# Altium schematic sheet Top_Level.SchDoc (part 2 of 2)
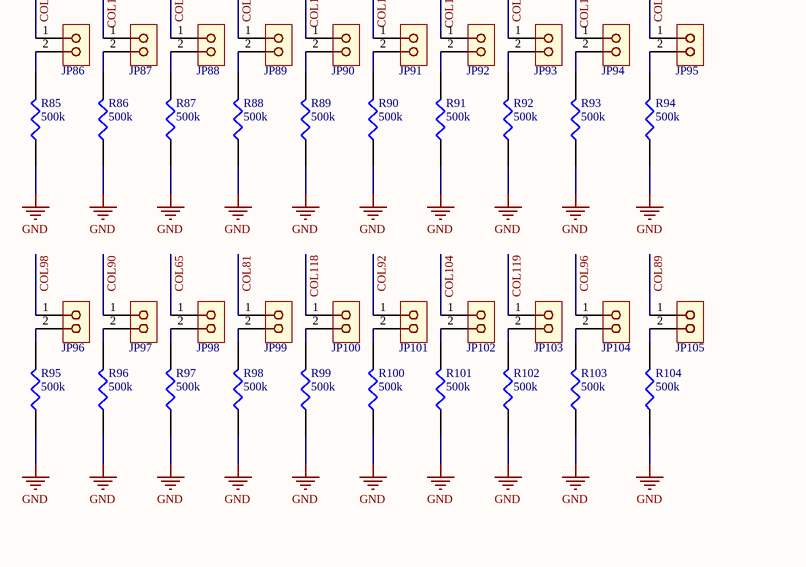
[diagram p12: Top_Level.SchDoc, bottom column 4 of 4]

## Nets
GND: C1.1 C2.1 C3.1 C4.1 FMC_HPC1.A1(GND) FMC_HPC1.A4(GND) FMC_HPC1.A5(GND) FMC_HPC1.A8(GND) FMC_HPC1.A9(GND) FMC_HPC1.A12(GND) FMC_HPC1.A13(GND) FMC_HPC1.A16(GND) FMC_HPC1.A17(GND) FMC_HPC1.A20(GND) FMC_HPC1.A21(GND) FMC_HPC1.A24(GND) FMC_HPC1.A25(GND) FMC_HPC1.A28(GND) FMC_HPC1.A29(GND) FMC_HPC1.A32(GND) FMC_HPC1.A33(GND) FMC_HPC1.A36(GND) FMC_HPC1.A37(GND) FMC_HPC1.A40(GND) FMC_HPC1.B2(GND) FMC_HPC1.B3(GND) FMC_HPC1.B6(GND) FMC_HPC1.B7(GND) FMC_HPC1.B10(GND) FMC_HPC1.B11(GND) FMC_HPC1.B14(GND) FMC_HPC1.B15(GND) FMC_HPC1.B18(GND) FMC_HPC1.B19(GND) FMC_HPC1.B22(GND) FMC_HPC1.B23(GND) FMC_HPC1.B26(GND) FMC_HPC1.B27(GND) FMC_HPC1.B30(GND) FMC_HPC1.B31(GND) FMC_HPC1.B34(GND) FMC_HPC1.B35(GND) FMC_HPC1.B38(GND) FMC_HPC1.B39(GND) FMC_HPC1.C1(GND) FMC_HPC1.C4(GND) FMC_HPC1.C5(GND) FMC_HPC1.C8(GND) FMC_HPC1.C9(GND) FMC_HPC1.C12(GND) FMC_HPC1.C13(GND) FMC_HPC1.C16(GND) FMC_HPC1.C17(GND) FMC_HPC1.C20(GND) FMC_HPC1.C21(GND) FMC_HPC1.C24(GND) FMC_HPC1.C25(GND) FMC_HPC1.C28(GND) FMC_HPC1.C29(GND) FMC_HPC1.C32(GND) FMC_HPC1.C33(GND) FMC_HPC1.C36(GND) FMC_HPC1.C38(GND) FMC_HPC1.C40(GND) FMC_HPC1.D2(GND) FMC_HPC1.D3(GND) FMC_HPC1.D6(GND) FMC_HPC1.D7(GND) FMC_HPC1.D10(GND) FMC_HPC1.D13(GND) FMC_HPC1.D16(GND) FMC_HPC1.D19(GND) FMC_HPC1.D22(GND) FMC_HPC1.D25(GND) FMC_HPC1.D28(GND) FMC_HPC1.D37(GND) FMC_HPC1.D39(GND) FMC_HPC1.E1(GND) FMC_HPC1.E4(GND) FMC_HPC1.E5(GND) FMC_HPC1.E8(GND) FMC_HPC1.E11(GND) FMC_HPC1.E14(GND) FMC_HPC1.E17(GND) FMC_HPC1.E20(GND) FMC_HPC1.E23(GND) FMC_HPC1.E26(GND) FMC_HPC1.E29(GND) FMC_HPC1.E32(GND) FMC_HPC1.E35(GND) FMC_HPC1.E38(GND) FMC_HPC1.E40(GND) FMC_HPC1.F2(GND) FMC_HPC1.F3(GND) FMC_HPC1.F6(GND) FMC_HPC1.F9(GND) FMC_HPC1.F12(GND) FMC_HPC1.F15(GND) FMC_HPC1.F18(GND) FMC_HPC1.F21(GND) FMC_HPC1.F24(GND) FMC_HPC1.F27(GND) FMC_HPC1.F30(GND) FMC_HPC1.F33(GND) FMC_HPC1.F36(GND) FMC_HPC1.F39(GND) FMC_HPC1.G1(GND) FMC_HPC1.G4(GND) FMC_HPC1.G5(GND) FMC_HPC1.G8(GND) FMC_HPC1.G11(GND) FMC_HPC1.G14(GND) FMC_HPC1.G17(GND) FMC_HPC1.G20(GND) FMC_HPC1.G23(GND) FMC_HPC1.G26(GND) FMC_HPC1.G29(GND) FMC_HPC1.G32(GND) FMC_HPC1.G35(GND) FMC_HPC1.G38(GND) FMC_HPC1.G40(GND) FMC_HPC1.H3(GND) FMC_HPC1.H6(GND) FMC_HPC1.H9(GND) FMC_HPC1.H12(GND) FMC_HPC1.H15(GND) FMC_HPC1.H18(GND) FMC_HPC1.H21(GND) FMC_HPC1.H24(GND) FMC_HPC1.H27(GND) FMC_HPC1.H30(GND) FMC_HPC1.H33(GND) FMC_HPC1.H36(GND) FMC_HPC1.H39(GND) FMC_HPC1.J1(GND) FMC_HPC1.J4(GND) FMC_HPC1.J5(GND) FMC_HPC1.J8(GND) FMC_HPC1.J11(GND) FMC_HPC1.J14(GND) FMC_HPC1.J17(GND) FMC_HPC1.J20(GND) FMC_HPC1.J23(GND) FMC_HPC1.J26(GND) FMC_HPC1.J29(GND) FMC_HPC1.J32(GND) FMC_HPC1.J35(GND) FMC_HPC1.J38(GND) FMC_HPC1.J40(GND) FMC_HPC1.K2(GND) FMC_HPC1.K3(GND) FMC_HPC1.K6(GND) FMC_HPC1.K9(GND) FMC_HPC1.K12(GND) FMC_HPC1.K15(GND) FMC_HPC1.K18(GND) FMC_HPC1.K21(GND) FMC_HPC1.K24(GND) FMC_HPC1.K27(GND) FMC_HPC1.K30(GND) FMC_HPC1.K33(GND) FMC_HPC1.K36(GND) FMC_HPC1.K39(GND) ICXTRAP1.AK12(VSS) JP1.3 JP1.4 MH1.1 MH2.1 MH3.1 MH4.1 POWER1.2 POWER1.3 R1.1 R2.1 R3.1 R4.1 R5.1 R6.1 R7.1 R8.1 R9.1 R10.1 R11.1 R12.1 R13.1 R14.1 R15.1 R16.1 R17.1 R18.1 R19.1 R20.1 R21.1 R22.1 R23.1 R24.1 R25.1 R26.1 R27.1 R28.1 R29.1 R30.1 R31.1 R32.1 R33.1 R34.1 R35.1 R36.1 R37.1 R38.1 R39.1 R40.1 R41.1 R42.1 R43.1 R44.1 R45.1 R46.1 R47.1 R48.1 R49.1 R50.1 R51.1 R52.1 R53.1 R54.1 R55.1 R56.1 R57.1 R58.1 R59.1 R60.1 R61.1 R62.1 R63.1 R64.1 R65.1 R66.1 R67.1 R68.1 R69.1 R70.1 R71.1 R72.1 R73.1 R74.1 R75.1 R76.1 R77.1 R78.1 R79.1 R80.1 R81.1 R82.1 R83.1 R84.1 R85.1 R86.1 R87.1 R88.1 R89.1 R90.1 R91.1 R92.1 R93.1 R94.1 R95.1 R96.1 R97.1 R98.1 R99.1 R100.1 R101.1 R102.1 R103.1 R104.1 ; sheet DAC80508Z1/GND, sheet DAC80508Z2/GND, sheet 12V_2_5V_1/GND, sheet ADJ_LDO_1/GND, sheet ADJ_LDO_2/GND, sheet TIA1/GND, sheet TIA2/GND, sheet TIA3/GND, sheet TIA4/GND, sheet TIA5/GND, sheet TIA6/GND, sheet ADC_8CH_1/GND, sheet ADC_4CH_1/GND, sheet ADC_4CH_2/GND, sheet 12V_2_5V_2/GND, sheet ADJ_LDO_3/GND, sheet ADJ_LDO_4/GND, sheet ADJ_LDO_5/GND, sheet DAC3/GND, sheet ad7606/GND, sheet ADJ_LDO_6/GND, sheet 12V_2_5V_3/GND, sheet ADJ_LDO_7/GND, sheet ADJ_LDO_8/GND, sheet ADJ_LDO_9/GND, sheet DAC80508Z4/GND, sheet DAC5/GND, sheet BT_SW_MUX/GND, sheet DAC_SW_MUX/GND, sheet levelShifter1/GND, sheet levelShifter2/GND, sheet levelShifter3/GND, sheet SerDes1/GND, sheet levelShifter4/GND, sheet levelShifter5/GND, sheet levelShifter6/GND, sheet levelShifter7/GND, sheet 12V_2_5V_4/GND, sheet ADJ_LDO_10/GND, sheet ADJ_LDO_11/GND
5V_DAC1_2: sheet DAC80508Z1/VDD_DAC, sheet DAC80508Z2/VDD_DAC, sheet 12V_2_5V_1/VOUT_5V, sheet ADJ_LDO_1/5V_IN, sheet ADJ_LDO_2/5V_IN, sheet DAC3/VDD, sheet DAC_SW_MUX/VDD, sheet levelShifter2/VCCB, sheet levelShifter3/VCCB
5V_DAC1_3: sheet DAC80508Z4/VDD_DAC, sheet DAC5/VDD
5V_SerDes: sheet 12V_2_5V_4/VOUT_5V, sheet ADJ_LDO_10/5V_IN, sheet ADJ_LDO_11/5V_IN
ACOL1: sheet TIA1/INI1, sheet BT_SW_MUX/M1A
ACOL2: sheet TIA1/INI2, sheet BT_SW_MUX/M2A
ACOL3: sheet TIA1/INI3, sheet BT_SW_MUX/M3A
ACOL4: sheet TIA1/INI4, sheet BT_SW_MUX/M4A
ACOL5: sheet TIA2/INI1, sheet BT_SW_MUX/M5A
ACOL6: sheet TIA2/INI2, sheet BT_SW_MUX/M6A
ACOL7: sheet TIA2/INI3, sheet BT_SW_MUX/M7A
ACOL8: sheet TIA2/INI4, sheet BT_SW_MUX/M8A
ACOL9: sheet TIA3/INI1, sheet BT_SW_MUX/M9A
ACOL10: sheet TIA3/INI2, sheet BT_SW_MUX/M10A
ACOL11: sheet TIA3/INI3, sheet BT_SW_MUX/M11A
ACOL12: sheet TIA3/INI4, sheet BT_SW_MUX/M12A
ACOL13: sheet TIA4/INI1, sheet BT_SW_MUX/M13A
ACOL14: sheet TIA4/INI2, sheet BT_SW_MUX/M14A
ACOL15: sheet TIA4/INI3, sheet BT_SW_MUX/M15A
ACOL16: sheet TIA4/INI4, sheet BT_SW_MUX/M16A
ACOL17: sheet TIA5/INI1, sheet BT_SW_MUX/M17A
ACOL18: sheet TIA5/INI2, sheet BT_SW_MUX/M18A
ACOL19: sheet TIA5/INI3, sheet BT_SW_MUX/M19A
ACOL20: sheet TIA5/INI4, sheet BT_SW_MUX/M20A
ACOL21: sheet TIA6/INI1, sheet BT_SW_MUX/M21A
ACOL22: sheet TIA6/INI2, sheet BT_SW_MUX/M22A
ACOL23: sheet TIA6/INI3, sheet BT_SW_MUX/M23A
ACOL24: sheet TIA6/INI4, sheet BT_SW_MUX/M24A
ADC1_~{CLKEN}: FMC_HPC1.H34(LA30_P) ; sheet ADC_8CH_1/~{CLKEN}
ADC1_~{CNV}: FMC_HPC1.G31(LA29_N) ; sheet ADC_8CH_1/~{CNV}
ADC1_CLKOUT: FMC_HPC1.G30(LA29_P) ; sheet ADC_8CH_1/CLKOUT
ADC1_SCK: FMC_HPC1.H32(LA28_N) ; sheet ADC_8CH_1/SCK
ADC1_SDO1: FMC_HPC1.H26(LA21_N) ; sheet ADC_8CH_1/SDO1
ADC1_SDO2: FMC_HPC1.G24(LA22_P) ; sheet ADC_8CH_1/SDO2
ADC1_SDO3: FMC_HPC1.H25(LA21_P) ; sheet ADC_8CH_1/SDO3
ADC1_SDO4: FMC_HPC1.G22(LA20_N) ; sheet ADC_8CH_1/SDO4
ADC1_SDO5: FMC_HPC1.H23(LA19_N) ; sheet ADC_8CH_1/SDO5
ADC1_SDO6: FMC_HPC1.G21(LA20_P) ; sheet ADC_8CH_1/SDO6
ADC1_SDO7: FMC_HPC1.H22(LA19_P) ; sheet ADC_8CH_1/SDO7
ADC1_SDO8: FMC_HPC1.G19(LA16_N) ; sheet ADC_8CH_1/SDO8
ADC2_~{CLKEN}: FMC_HPC1.C11(LA06_N) ; sheet ADC_4CH_1/~{CLKEN}
ADC2_~{CNV}: FMC_HPC1.C15(LA10_N) ; sheet ADC_4CH_1/~{CN}V
ADC2_CLKOUT: FMC_HPC1.D11(LA05_P) ; sheet ADC_4CH_1/CLKOUT
ADC2_SCK: FMC_HPC1.D8(LA01_P_CC) ; sheet ADC_4CH_1/SCK
ADC2_SDO1: FMC_HPC1.C14(LA10_P) ; sheet ADC_4CH_1/SDO1
ADC2_SDO2: FMC_HPC1.D12(LA05_N) ; sheet ADC_4CH_1/SDO2
ADC2_SDO3: FMC_HPC1.D9(LA01_N_CC) ; sheet ADC_4CH_1/SDO3
ADC2_SDO4: FMC_HPC1.C10(LA06_P) ; sheet ADC_4CH_1/SDO4
ADC3_~{CLKEN}: FMC_HPC1.E13(HA13_N) ; sheet ADC_4CH_2/~{CLKEN}
ADC3_~{CNV}: FMC_HPC1.E19(HA20_N) ; sheet ADC_4CH_2/~{CN}V
ADC3_CLKOUT: FMC_HPC1.E15(HA16_P) ; sheet ADC_4CH_2/CLKOUT
ADC3_SCK: FMC_HPC1.E9(HA09_P) ; sheet ADC_4CH_2/SCK
ADC3_SDO1: FMC_HPC1.E18(HA20_P) ; sheet ADC_4CH_2/SDO1
ADC3_SDO2: FMC_HPC1.E16(HA16_N) ; sheet ADC_4CH_2/SDO2
ADC3_SDO3: FMC_HPC1.E12(HA13_P) ; sheet ADC_4CH_2/SDO3
ADC3_SDO4: FMC_HPC1.E10(HA09_N) ; sheet ADC_4CH_2/SDO4
ADC4_BUSY: FMC_HPC1.H19(LA15_P) ; sheet ad7606/BUSY
ADC4_~{CS}: FMC_HPC1.J6(HA03_P) ; sheet ad7606/~{CS}
ADC4_CONVST: FMC_HPC1.J15(HA14_P) ; sheet ad7606/CONVST
ADC4_D0: FMC_HPC1.H17(LA11_N) ; sheet ad7606/D0
ADC4_D1: FMC_HPC1.G16(LA12_N) ; sheet ad7606/D1
ADC4_D2: FMC_HPC1.H16(LA11_P) ; sheet ad7606/D2
ADC4_D3: FMC_HPC1.G15(LA12_P) ; sheet ad7606/D3
ADC4_D4: FMC_HPC1.H14(LA07_N) ; sheet ad7606/D4
ADC4_D5: FMC_HPC1.G13(LA08_N) ; sheet ad7606/D5
ADC4_D6: FMC_HPC1.H13(LA07_P) ; sheet ad7606/D6
ADC4_D7: FMC_HPC1.G12(LA08_P) ; sheet ad7606/D7
ADC4_D8: FMC_HPC1.H11(LA04_N) ; sheet ad7606/D8
ADC4_D9: FMC_HPC1.G10(LA03_N) ; sheet ad7606/D9
ADC4_D10: FMC_HPC1.H10(LA04_P) ; sheet ad7606/D10
ADC4_D11: FMC_HPC1.G9(LA03_P) ; sheet ad7606/D11
ADC4_D12: FMC_HPC1.H8(LA02_N) ; sheet ad7606/D12
ADC4_D13: FMC_HPC1.G7(LA00_N_CC) ; sheet ad7606/D13
ADC4_D14: FMC_HPC1.H7(LA02_P) ; sheet ad7606/D14
ADC4_D15: FMC_HPC1.G6(LA00_P_CC) ; sheet ad7606/D15
ADC4_FRSTDATA: FMC_HPC1.G18(LA16_P) ; sheet ad7606/FRSTDATA
ADC4_OS0: FMC_HPC1.J22(HA22_N) ; sheet ad7606/OS0
ADC4_OS1: FMC_HPC1.J21(HA22_P) ; sheet ad7606/OS1
ADC4_OS2: FMC_HPC1.J19(HA18_N) ; sheet ad7606/OS2
ADC4_~{PAR}/SER/BYTESEL: FMC_HPC1.J16(HA14_N) ; sheet ad7606/~{PAR}/SER/BYTESEL
ADC4_~{RD}/SCLK: FMC_HPC1.J10(HA07_N) ; sheet ad7606/~{RD}/SCLK
ADC4_RANGE: FMC_HPC1.J18(HA18_P) ; sheet ad7606/RANGE
ADC4_REFSELECT: FMC_HPC1.J7(HA03_N) ; sheet ad7606/REFSELECT
ADC4_RESET: FMC_HPC1.J9(HA07_P) ; sheet ad7606/RESET
ADC4_~{STBY}: FMC_HPC1.J13(HA11_N) ; sheet ad7606/~{STBY}
ADC4_~{WR}: FMC_HPC1.J12(HA11_P) ; sheet ad7606/~{WR}
ADDR1: FMC_HPC1.K19(HA21_P) ; sheet SerDes1/ADDR1
ADDR2: FMC_HPC1.K17(HA17_N_CC) ; sheet SerDes1/ADDR2
ADDR3: FMC_HPC1.K16(HA17_P_CC) ; sheet SerDes1/ADDR3
ADDR4: FMC_HPC1.K11(HA06_N) ; sheet SerDes1/ADDR4
ADDR5: FMC_HPC1.K10(HA06_P) ; sheet SerDes1/ADDR5
ADDR6: FMC_HPC1.K8(HA02_N) ; sheet SerDes1/ADDR6
~{CS}: FMC_HPC1.H20(LA15_N) ; sheet SerDes1/~{CS}
COL1: ICXTRAP1.AP20(C15) ; sheet BT_SW_MUX/M16
COL2: ICXTRAP1.AR21(C39) JP16.1
COL3: ICXTRAP1.AR23(C1) ; sheet BT_SW_MUX/M19
COL4: ICXTRAP1.AN19(C16) ; sheet BT_SW_MUX/M12
COL5: ICXTRAP1.AR27(C25) JP2.1
COL6: ICXTRAP1.AL23(C50) JP27.1
COL7: ICXTRAP1.AN25(C17) ; sheet BT_SW_MUX/M24
COL8: ICXTRAP1.AP26(C28) JP5.1
COL9: ICXTRAP1.AR19(C64) JP41.1
COL10: ICXTRAP1.AP18(C57) JP34.1
COL11: ICXTRAP1.AM18(C30) JP7.1
COL12: ICXTRAP1.AK18(C27) JP4.1
COL13: ICXTRAP1.AK22(C53) JP30.1
COL14: ICXTRAP1.AN23(C12) ; sheet BT_SW_MUX/M22
COL15: ICXTRAP1.AM24(C58) JP35.1
COL16: ICXTRAP1.AJ21(C45) JP22.1
COL17: ICXTRAP1.AK14(C23) ; sheet BT_SW_MUX/M17
COL18: ICXTRAP1.AJ15(C6) ; sheet BT_SW_MUX/M13
COL19: ICXTRAP1.AM12(C48) JP25.1
COL20: ICXTRAP1.AL13(C8) ; sheet BT_SW_MUX/M4
COL21: ICXTRAP1.AJ17(C22) ; sheet BT_SW_MUX/M15
COL22: ICXTRAP1.AR9(C18) ; sheet BT_SW_MUX/M3
COL23: ICXTRAP1.AP10(C29) JP6.1
COL24: ICXTRAP1.AN11(C26) JP3.1
COL25: ICXTRAP1.AN9(C10) ; sheet BT_SW_MUX/M8
COL26: ICXTRAP1.AJ13(C32) JP9.1
COL27: ICXTRAP1.AP8(C21) ; sheet BT_SW_MUX/M7
COL28: ICXTRAP1.AR7(C13) ; sheet BT_SW_MUX/M2
COL29: ICXTRAP1.AR11(C37) JP14.1
COL30: ICXTRAP1.AM14(C47) JP24.1
COL31: ICXTRAP1.AL15(C3) ; sheet BT_SW_MUX/M10
COL32: ICXTRAP1.AK16(C14) ; sheet BT_SW_MUX/M21
COL33: ICXTRAP1.AP14(C33) JP10.1
COL34: ICXTRAP1.AN15(C44) JP21.1
COL35: ICXTRAP1.AM16(C11) ; sheet BT_SW_MUX/M14
COL36: ICXTRAP1.AL17(C19) ; sheet BT_SW_MUX/M11
COL37: ICXTRAP1.AP6(C5) ; sheet BT_SW_MUX/M9
COL38: ICXTRAP1.AN7(C55) JP32.1
COL39: ICXTRAP1.AN29(C43) JP20.1
COL40: ICXTRAP1.AR5(C2) ; sheet BT_SW_MUX/M1
COL41: ICXTRAP1.AR17(C60) JP37.1
COL42: ICXTRAP1.AP16(C52) JP29.1
COL43: ICXTRAP1.AR15(C41) JP18.1
COL44: ICXTRAP1.AN17(C49) JP26.1
COL45: ICXTRAP1.AN5(C24) ; sheet BT_SW_MUX/M6
COL46: ICXTRAP1.AP2(C40) JP17.1
COL47: ICXTRAP1.AR3(C31) JP8.1
COL48: ICXTRAP1.AP4(C7) ; sheet BT_SW_MUX/M5
COL49: ICXTRAP1.AP30(C46) JP23.1
COL50: ICXTRAP1.AJ23(C61) JP38.1
COL51: ICXTRAP1.AK24(C56) JP33.1
COL52: ICXTRAP1.AP28(C36) JP13.1
COL53: ICXTRAP1.AJ19(C35) JP12.1
COL54: ICXTRAP1.AN21(C63) JP40.1
COL55: ICXTRAP1.AP22(C4) ; sheet BT_SW_MUX/M18
COL56: ICXTRAP1.AL19(C38) JP15.1
COL57: ICXTRAP1.AN33(C59) JP36.1
COL58: ICXTRAP1.AP32(C51) JP28.1
COL59: ICXTRAP1.AR33(C54) JP31.1
COL60: ICXTRAP1.AN31(C62) JP39.1
COL61: ICXTRAP1.AP24(C9) ; sheet BT_SW_MUX/M23
COL62: ICXTRAP1.AR25(C20) ; sheet BT_SW_MUX/M20
COL63: ICXTRAP1.AL21(C34) JP11.1
COL64: ICXTRAP1.AM22(C42) JP19.1
COL65: ICXTRAP1.C17(C121) JP98.1
COL66: ICXTRAP1.B16(C106) JP83.1
COL67: ICXTRAP1.E17(C92) JP69.1
COL68: ICXTRAP1.D16(C84) JP61.1
COL69: ICXTRAP1.A9(C91) JP68.1
COL70: ICXTRAP1.E13(SC65) JP42.1
COL71: ICXTRAP1.C11(C99) JP76.1
COL72: ICXTRAP1.B10(C102) JP79.1
COL73: ICXTRAP1.F18(C103) JP80.1
COL74: ICXTRAP1.B20(C69) JP46.1
COL75: ICXTRAP1.A15(C82) JP59.1
COL76: ICXTRAP1.D18(C100) JP77.1
COL77: ICXTRAP1.C13(C118) JP95.1
COL78: ICXTRAP1.B12(C107) JP84.1
COL79: ICXTRAP1.G15(C79) JP56.1
COL80: ICXTRAP1.F14(C71) JP48.1
COL81: ICXTRAP1.E23(C122) JP99.1
COL82: ICXTRAP1.F22(C98) JP75.1
COL83: ICXTRAP1.C25(C101) JP78.1
COL84: ICXTRAP1.D24(C89) JP66.1
COL85: ICXTRAP1.F20(C116) JP93.1
COL86: ICXTRAP1.G19(C108) JP85.1
COL87: ICXTRAP1.A27(C109) JP86.1
COL88: ICXTRAP1.B26(C112) JP89.1
COL89: ICXTRAP1.A29(C128) JP105.1
COL90: ICXTRAP1.B28(C120) JP97.1
COL91: ICXTRAP1.G23(C105) JP82.1
COL92: ICXTRAP1.G21(C124) JP101.1
COL93: ICXTRAP1.B24(C93) JP70.1
COL94: ICXTRAP1.C23(C96) JP73.1
COL95: ICXTRAP1.D22(C74) JP51.1
COL96: ICXTRAP1.E21(C127) JP104.1
COL97: ICXTRAP1.C21(C77) JP54.1
COL98: ICXTRAP1.D20(C119) JP96.1
COL99: ICXTRAP1.E19(C111) JP88.1
COL100: ICXTRAP1.A25(C104) JP81.1
COL101: ICXTRAP1.B30(C66) JP43.1
COL102: ICXTRAP1.C29(C90) JP67.1
COL103: ICXTRAP1.C27(C117) JP94.1
COL104: ICXTRAP1.A31(C125) JP102.1
COL105: ICXTRAP1.A21(C80) JP57.1
COL106: ICXTRAP1.C19(C72) JP49.1
COL107: ICXTRAP1.A23(C85) JP62.1
COL108: ICXTRAP1.B22(C88) JP65.1
COL109: ICXTRAP1.C31(C97) JP74.1
COL110: ICXTRAP1.B34(C81) JP58.1
COL111: ICXTRAP1.A33(C114) JP91.1
COL112: ICXTRAP1.B32(C113) JP90.1
COL113: ICXTRAP1.A5(C75) JP52.1
COL114: ICXTRAP1.C9(C83) JP60.1
COL115: ICXTRAP1.B8(C94) JP71.1
COL116: ICXTRAP1.A7(C86) JP63.1
COL117: ICXTRAP1.F16(C87) JP64.1
COL118: ICXTRAP1.C15(C123) JP100.1
COL119: ICXTRAP1.B14(C126) JP103.1
COL120: ICXTRAP1.A13(C115) JP92.1
COL121: ICXTRAP1.B4(C73) JP50.1
COL122: ICXTRAP1.A3(C70) JP47.1
COL123: ICXTRAP1.C7(C67) JP44.1
COL124: ICXTRAP1.B6(C78) JP55.1
COL125: ICXTRAP1.A11(C110) JP87.1
COL126: ICXTRAP1.E15(C76) JP53.1
COL127: ICXTRAP1.D14(C68) JP45.1
COL128: ICXTRAP1.G17(C95) JP72.1
COL_DIN1: sheet BT_SW_MUX/DIN1, sheet levelShifter1/OUT4
COL_DIN1_FPGA: FMC_HPC1.F20(HA19_N) ; sheet levelShifter1/IN4
COL_DIN2: sheet BT_SW_MUX/DIN2, sheet levelShifter1/OUT5
COL_DIN2_FPGA: FMC_HPC1.D26(LA26_P) ; sheet levelShifter1/IN5
COL_DIN3: sheet BT_SW_MUX/DIN3, sheet levelShifter1/OUT6
COL_DIN3_FPGA: FMC_HPC1.D27(LA26_N) ; sheet levelShifter1/IN6
DAC1_~{CS}: FMC_HPC1.C22(LA18_P_CC) ; sheet DAC80508Z1/~{CS}
DAC1_OUT0: sheet DAC80508Z2/OUT0, sheet DAC_SW_MUX/IN1
DAC1_OUT1: sheet DAC80508Z2/OUT1, sheet DAC_SW_MUX/IN2
DAC1_OUT2: sheet DAC80508Z1/OUT4, sheet DAC_SW_MUX/IN3
DAC1_OUT3: sheet DAC80508Z1/OUT5, sheet DAC_SW_MUX/IN4
DAC1_OUT4: sheet DAC80508Z2/OUT4, sheet DAC_SW_MUX/IN5
DAC1_OUT5: sheet DAC80508Z2/OUT5, sheet DAC_SW_MUX/IN6
DAC1_OUT6: sheet DAC80508Z1/OUT0, sheet DAC_SW_MUX/IN7
DAC1_OUT7: sheet DAC80508Z1/OUT1, sheet DAC_SW_MUX/IN8
DAC1_SCLK: FMC_HPC1.C19(LA14_N) ; sheet DAC80508Z1/SCLK
DAC1_SDI: FMC_HPC1.C18(LA14_P) ; sheet DAC80508Z1/SDI
DAC1_SDO: sheet DAC80508Z1/SDO
DAC2_~{CS}: FMC_HPC1.C27(LA27_N) ; sheet DAC80508Z2/~{CS}
DAC2_OUT0: sheet DAC80508Z1/OUT2, sheet DAC_SW_MUX/IN9
DAC2_OUT1: sheet DAC80508Z1/OUT3, sheet DAC_SW_MUX/IN10
DAC2_OUT2: sheet DAC80508Z1/OUT6, sheet DAC_SW_MUX/IN11
DAC2_OUT3: sheet DAC80508Z1/OUT7, sheet DAC_SW_MUX/IN12
DAC2_OUT4: sheet DAC80508Z2/OUT6, sheet DAC_SW_MUX/IN13
DAC2_OUT5: sheet DAC80508Z2/OUT7, sheet DAC_SW_MUX/IN14
DAC2_OUT6: sheet DAC80508Z2/OUT2, sheet DAC_SW_MUX/IN15
DAC2_OUT7: sheet DAC80508Z2/OUT3, sheet DAC_SW_MUX/IN16
DAC2_SCLK: FMC_HPC1.C26(LA27_P) ; sheet DAC80508Z2/SCLK
DAC2_SDI: FMC_HPC1.C23(LA18_N_CC) ; sheet DAC80508Z2/SDI
DAC2_SDO: sheet DAC80508Z2/SDO
DAC3_GAIN: FMC_HPC1.G25(LA22_N) ; sheet DAC3/GAIN
DAC3_~{LDAC}: FMC_HPC1.G28(LA25_N) ; sheet DAC3/~{LDAC}
DAC3_OUT0: sheet DAC3/VOUT2, sheet DAC_SW_MUX/IN17
DAC3_OUT1: sheet DAC3/VOUT3, sheet DAC_SW_MUX/IN18
DAC3_OUT2: sheet DAC3/VOUT8, sheet DAC_SW_MUX/IN19
DAC3_OUT3: sheet DAC3/VOUT9, sheet DAC_SW_MUX/IN20
DAC3_OUT4: sheet DAC3/VOUT0, sheet DAC_SW_MUX/IN21
DAC3_OUT5: sheet DAC3/VOUT1, sheet DAC_SW_MUX/IN22
DAC3_OUT6: sheet DAC3/VOUT10, sheet DAC_SW_MUX/IN23
DAC3_OUT7: sheet DAC3/VOUT11, sheet DAC_SW_MUX/IN24
DAC3_OUT8: sheet DAC3/VOUT6, sheet DAC_SW_MUX/IN25
DAC3_OUT9: sheet DAC3/VOUT7, sheet DAC_SW_MUX/IN26
DAC3_OUT10: sheet DAC3/VOUT14, sheet DAC_SW_MUX/IN27
DAC3_OUT11: sheet DAC3/VOUT15, sheet DAC_SW_MUX/IN28
DAC3_OUT12: sheet DAC3/VOUT12, sheet DAC_SW_MUX/IN29
DAC3_OUT13: sheet DAC3/VOUT13, sheet DAC_SW_MUX/IN30
DAC3_OUT14: sheet DAC3/VOUT4, sheet DAC_SW_MUX/IN31
DAC3_OUT15: sheet DAC3/VOUT5, sheet DAC_SW_MUX/IN32
DAC3_~{RESET}: FMC_HPC1.H29(LA24_N) ; sheet DAC3/~{RESET}
DAC3_~{SYNC}: FMC_HPC1.H31(LA28_P) ; sheet DAC3/~{SYNC}
DAC3_SCLK: FMC_HPC1.G27(LA25_P) ; sheet DAC3/SCLK
DAC3_SDI: FMC_HPC1.H28(LA24_P) ; sheet DAC3/SDI
DAC3_SDO: sheet DAC3/SDO
DAC4_~{CS}: FMC_HPC1.E7(HA05_N) ; sheet DAC80508Z4/~{CS}
DAC4_OUT1: sheet DAC80508Z4/OUT0, sheet BT_SW_MUX/M17B
DAC4_OUT2: sheet DAC80508Z4/OUT1, sheet BT_SW_MUX/M18B
DAC4_OUT3: sheet DAC80508Z4/OUT2, sheet BT_SW_MUX/M19B
DAC4_OUT4: sheet DAC80508Z4/OUT3, sheet BT_SW_MUX/M20B
DAC4_OUT5: sheet DAC80508Z4/OUT4, sheet BT_SW_MUX/M21B
DAC4_OUT6: sheet DAC80508Z4/OUT5, sheet BT_SW_MUX/M22B
DAC4_OUT7: sheet DAC80508Z4/OUT6, sheet BT_SW_MUX/M23B
DAC4_OUT8: sheet DAC80508Z4/OUT7, sheet BT_SW_MUX/M24B
DAC4_SCLK: FMC_HPC1.E6(HA05_P) ; sheet DAC80508Z4/SCLK
DAC4_SDI: FMC_HPC1.E3(HA01_N_CC) ; sheet DAC80508Z4/SDI
DAC4_SDO: FMC_HPC1.E2(HA01_P_CC) ; sheet DAC80508Z4/SDO
DAC5_GAIN: FMC_HPC1.G33(LA31_P) ; sheet DAC5/GAIN
DAC5_~{LDAC}: FMC_HPC1.H38(LA32_N) ; sheet DAC5/~{LDAC}
DAC5_OUT1: sheet DAC5/VOUT0, sheet BT_SW_MUX/M1B
DAC5_OUT2: sheet DAC5/VOUT1, sheet BT_SW_MUX/M2B
DAC5_OUT3: sheet DAC5/VOUT2, sheet BT_SW_MUX/M3B
DAC5_OUT4: sheet DAC5/VOUT3, sheet BT_SW_MUX/M4B
DAC5_OUT5: sheet DAC5/VOUT4, sheet BT_SW_MUX/M5B
DAC5_OUT6: sheet DAC5/VOUT5, sheet BT_SW_MUX/M6B
DAC5_OUT7: sheet DAC5/VOUT6, sheet BT_SW_MUX/M7B
DAC5_OUT8: sheet DAC5/VOUT7, sheet BT_SW_MUX/M8B
DAC5_OUT9: sheet DAC5/VOUT8, sheet BT_SW_MUX/M9B
DAC5_OUT10: sheet DAC5/VOUT9, sheet BT_SW_MUX/M10B
DAC5_OUT11: sheet DAC5/VOUT10, sheet BT_SW_MUX/M11B
DAC5_OUT12: sheet DAC5/VOUT11, sheet BT_SW_MUX/M12B
DAC5_OUT13: sheet DAC5/VOUT12, sheet BT_SW_MUX/M13B
DAC5_OUT14: sheet DAC5/VOUT13, sheet BT_SW_MUX/M14B
DAC5_OUT15: sheet DAC5/VOUT14, sheet BT_SW_MUX/M15B
DAC5_OUT16: sheet DAC5/VOUT15, sheet BT_SW_MUX/M16B
DAC5_~{RESET}: FMC_HPC1.G36(LA33_P) ; sheet DAC5/~{RESET}
DAC5_~{SYNC}: FMC_HPC1.G37(LA33_N) ; sheet DAC5/~{SYNC}
DAC5_SCLK: FMC_HPC1.H37(LA32_P) ; sheet DAC5/SCLK
DAC5_SDI: FMC_HPC1.G34(LA31_N) ; sheet DAC5/SDI
DAC5_SDO: FMC_HPC1.H35(LA30_N) ; sheet DAC5/SDO
Pre_Select1: sheet SerDes1/Select1, sheet levelShifter7/IN8
Pre_Select2: sheet SerDes1/Select2, sheet levelShifter7/IN7
Pre_Select3: sheet SerDes1/Select3, sheet levelShifter7/IN6
Pre_Select4: sheet SerDes1/Select4, sheet levelShifter7/IN5
Pre_Select5: sheet SerDes1/Select5, sheet levelShifter7/IN4
Pre_Select6: sheet SerDes1/Select6, sheet levelShifter7/IN3
Pre_Select7: sheet SerDes1/Select7, sheet levelShifter7/IN2
Pre_Select8: sheet SerDes1/Select8, sheet levelShifter7/IN1
Pre_Select9: sheet SerDes1/Select9, sheet levelShifter6/IN8
Pre_Select10: sheet SerDes1/Select10, sheet levelShifter6/IN7
Pre_Select11: sheet SerDes1/Select11, sheet levelShifter6/IN6
Pre_Select12: sheet SerDes1/Select12, sheet levelShifter6/IN5
Pre_Select13: sheet SerDes1/Select13, sheet levelShifter6/IN4
Pre_Select14: sheet SerDes1/Select14, sheet levelShifter6/IN3
Pre_Select15: sheet SerDes1/Select15, sheet levelShifter6/IN2
Pre_Select16: sheet SerDes1/Select16, sheet levelShifter6/IN1
Pre_Select17: sheet SerDes1/Select17, sheet levelShifter4/IN8
Pre_Select18: sheet SerDes1/Select18, sheet levelShifter4/IN7
Pre_Select19: sheet SerDes1/Select19, sheet levelShifter4/IN6
Pre_Select20: sheet SerDes1/Select20, sheet levelShifter4/IN5
Pre_Select21: sheet SerDes1/Select21, sheet levelShifter4/IN4
Pre_Select22: sheet SerDes1/Select22, sheet levelShifter4/IN3
Pre_Select23: sheet SerDes1/Select23, sheet levelShifter4/IN2
Pre_Select24: sheet SerDes1/Select24, sheet levelShifter4/IN1
Pre_Select25: sheet SerDes1/Select25, sheet levelShifter5/IN8
Pre_Select26: sheet SerDes1/Select26, sheet levelShifter5/IN7
Pre_Select27: sheet SerDes1/Select27, sheet levelShifter5/IN6
Pre_Select28: sheet SerDes1/Select28, sheet levelShifter5/IN5
Pre_Select29: sheet SerDes1/Select29, sheet levelShifter5/IN4
Pre_Select30: sheet SerDes1/Select30, sheet levelShifter5/IN3
Pre_Select31: sheet SerDes1/Select31, sheet levelShifter5/IN2
Pre_Select32: sheet SerDes1/Select32, sheet levelShifter5/IN1
~{RST}: FMC_HPC1.K7(HA02_P) ; sheet SerDes1/~{RST}
ROW1: ICXTRAP1.T32(R37) ; sheet DAC_SW_MUX/CH37
ROW2: ICXTRAP1.U33(R12) ; sheet DAC_SW_MUX/CH17
ROW3: ICXTRAP1.N35(R43) ; sheet DAC_SW_MUX/CH43, sheet DAC_SW_MUX/CH28
ROW4: ICXTRAP1.U31(R28)
ROW5: ICXTRAP1.P30(R55) ; sheet DAC_SW_MUX/CH55
ROW6: ICXTRAP1.N31(R63) ; sheet DAC_SW_MUX/CH63
ROW7: ICXTRAP1.N29(R60) ; sheet DAC_SW_MUX/CH60
ROW8: ICXTRAP1.R29(R49) ; sheet DAC_SW_MUX/CH49
ROW9: ICXTRAP1.V32(R16) ; sheet DAC_SW_MUX/CH16
ROW10: ICXTRAP1.V30(R22) ; sheet DAC_SW_MUX/CH22
ROW11: ICXTRAP1.T34(R41) ; sheet DAC_SW_MUX/CH41
ROW12: ICXTRAP1.R35(R18) ; sheet DAC_SW_MUX/CH18
ROW13: ICXTRAP1.J35(R30) ; sheet DAC_SW_MUX/CH30
ROW14: ICXTRAP1.U29(R31) ; sheet DAC_SW_MUX/CH31
ROW15: ICXTRAP1.L33(R21) ; sheet DAC_SW_MUX/CH21
ROW16: ICXTRAP1.K34(R24) ; sheet DAC_SW_MUX/CH24
ROW17: ICXTRAP1.AC31(R1) ; sheet DAC_SW_MUX/CH1
ROW18: ICXTRAP1.AF34(R20) ; sheet DAC_SW_MUX/CH20
ROW19: ICXTRAP1.AB30(R25) ; sheet DAC_SW_MUX/CH25
ROW20: ICXTRAP1.AA29(R26) ; sheet DAC_SW_MUX/CH26
ROW21: ICXTRAP1.AE35(R29) ; sheet DAC_SW_MUX/CH29
ROW22: ICXTRAP1.AD34(R32) ; sheet DAC_SW_MUX/CH32
ROW23: ICXTRAP1.AC33(R38) ; sheet DAC_SW_MUX/CH38
ROW24: ICXTRAP1.AG35(R14) ; sheet DAC_SW_MUX/CH14
ROW25: ICXTRAP1.AH34(R8) ; sheet DAC_SW_MUX/CH8
ROW26: ICXTRAP1.AG33(R5) ; sheet DAC_SW_MUX/CH5
ROW27: ICXTRAP1.AJ35(R35) ; sheet DAC_SW_MUX/CH35
ROW28: ICXTRAP1.AE33(R23) ; sheet DAC_SW_MUX/CH23
ROW29: ICXTRAP1.Y30(R27) ; sheet DAC_SW_MUX/CH27
ROW30: ICXTRAP1.W29(R7) ; sheet DAC_SW_MUX/CH7
ROW31: ICXTRAP1.AB32(R2) ; sheet DAC_SW_MUX/CH2
ROW32: ICXTRAP1.AA31(R3) ; sheet DAC_SW_MUX/CH3
ROW33: ICXTRAP1.W31(R13) ; sheet DAC_SW_MUX/CH13
ROW34: ICXTRAP1.AC35(R44) ; sheet DAC_SW_MUX/CH44
ROW35: ICXTRAP1.AB34(R47) ; sheet DAC_SW_MUX/CH47
ROW36: ICXTRAP1.AA33(R50) ; sheet DAC_SW_MUX/CH50
ROW37: ICXTRAP1.AK34(R34) ; sheet DAC_SW_MUX/CH34
ROW38: ICXTRAP1.AJ33(R10) ; sheet DAC_SW_MUX/CH10
ROW39: ICXTRAP1.AC29(R58) ; sheet DAC_SW_MUX/CH58
ROW40: ICXTRAP1.AL35(R11) ; sheet DAC_SW_MUX/CH11
ROW41: ICXTRAP1.Y34(R56) ; sheet DAC_SW_MUX/CH56
ROW42: ICXTRAP1.AA35(R53) ; sheet DAC_SW_MUX/CH53
ROW43: ICXTRAP1.W33(R62) ; sheet DAC_SW_MUX/CH62
ROW44: ICXTRAP1.Y32(R4) ; sheet DAC_SW_MUX/CH4
ROW45: ICXTRAP1.AL33(R59) ; sheet DAC_SW_MUX/CH59
ROW46: ICXTRAP1.AP34(R57) ; sheet DAC_SW_MUX/CH57
ROW47: ICXTRAP1.AN35(R33) ; sheet DAC_SW_MUX/CH33
ROW48: ICXTRAP1.AM34(R9) ; sheet DAC_SW_MUX/CH9
ROW49: ICXTRAP1.E35(R48) ; sheet DAC_SW_MUX/CH48
ROW50: ICXTRAP1.J33(R39) ; sheet DAC_SW_MUX/CH39
ROW51: ICXTRAP1.H34(R36) ; sheet DAC_SW_MUX/CH36
ROW52: ICXTRAP1.G35(R45) ; sheet DAC_SW_MUX/CH45
ROW53: ICXTRAP1.M34(R12) ; sheet DAC_SW_MUX/CH12
ROW54: ICXTRAP1.L35(R15) ; sheet DAC_SW_MUX/CH15
ROW55: ICXTRAP1.R33(R42) ; sheet DAC_SW_MUX/CH42
ROW56: ICXTRAP1.P34(R19) ; sheet DAC_SW_MUX/CH19
ROW57: ICXTRAP1.D34(R61) ; sheet DAC_SW_MUX/CH61
ROW58: ICXTRAP1.C35(R64) ; sheet DAC_SW_MUX/CH64
ROW59: ICXTRAP1.G33(R54) ; sheet DAC_SW_MUX/CH54
ROW60: ICXTRAP1.F34(R51) ; sheet DAC_SW_MUX/CH51
ROW61: ICXTRAP1.T30(R40) ; sheet DAC_SW_MUX/CH40
ROW62: ICXTRAP1.R31(R46) ; sheet DAC_SW_MUX/CH46
ROW63: ICXTRAP1.P32(R52) ; sheet DAC_SW_MUX/CH52
ROW64: ICXTRAP1.N33(R6) ; sheet DAC_SW_MUX/CH6
ROW65: ICXTRAP1.Y4(R101) ; sheet DAC_SW_MUX/CH101
ROW66: ICXTRAP1.W5(R113) ; sheet DAC_SW_MUX/CH113
ROW67: ICXTRAP1.AB2(R118) ; sheet DAC_SW_MUX/CH118
ROW68: ICXTRAP1.AA3(R95) ; sheet DAC_SW_MUX/CH95
ROW69: ICXTRAP1.AH2(R108) ; sheet DAC_SW_MUX/CH108
ROW70: ICXTRAP1.AJ1(R99) ; sheet DAC_SW_MUX/CH99
ROW71: ICXTRAP1.AD6(R68) ; sheet DAC_SW_MUX/CH68
ROW72: ICXTRAP1.AG3(R105) ; sheet DAC_SW_MUX/CH105
ROW73: ICXTRAP1.W3(R120) ; sheet DAC_SW_MUX/CH120
ROW74: ICXTRAP1.W1(R69) ; sheet DAC_SW_MUX/CH69
ROW75: ICXTRAP1.AA1(R119) ; sheet DAC_SW_MUX/CH119
ROW76: ICXTRAP1.Y2(R96) ; sheet DAC_SW_MUX/CH96
ROW77: ICXTRAP1.AC5(R77) ; sheet DAC_SW_MUX/CH77
ROW78: ICXTRAP1.AD4(R66) ; sheet DAC_SW_MUX/CH66
ROW79: ICXTRAP1.AA7(R89) ; sheet DAC_SW_MUX/CH89
ROW80: ICXTRAP1.AB6(R90) ; sheet DAC_SW_MUX/CH80
ROW81: ICXTRAP1.R7(R87) ; sheet DAC_SW_MUX/CH87
ROW82: ICXTRAP1.M4(R72) ; sheet DAC_SW_MUX/CH72
ROW83: ICXTRAP1.N3(R100) ; sheet DAC_SW_MUX/CH100
ROW84: ICXTRAP1.P6(R88) ; sheet DAC_SW_MUX/CH88
ROW85: ICXTRAP1.U7(R117) ; sheet DAC_SW_MUX/CH117
ROW86: ICXTRAP1.P4(R111) ; sheet DAC_SW_MUX/CH111
ROW87: ICXTRAP1.R5(R110) ; sheet DAC_SW_MUX/CH110
ROW88: ICXTRAP1.M2(R106) ; sheet DAC_SW_MUX/CH106
ROW89: ICXTRAP1.H2(R116) ; sheet DAC_SW_MUX/CH116
ROW90: ICXTRAP1.J3(R122) ; sheet DAC_SW_MUX/CH122
ROW91: ICXTRAP1.G1(R125) ; sheet DAC_SW_MUX/CH125
ROW92: ICXTRAP1.N5(R112) ; sheet DAC_SW_MUX/CH112
ROW93: ICXTRAP1.P2(R91) ; sheet DAC_SW_MUX/CH91
ROW94: ICXTRAP1.R3(R85) ; sheet DAC_SW_MUX/CH85
ROW95: ICXTRAP1.L1(R109) ; sheet DAC_SW_MUX/CH109
ROW96: ICXTRAP1.T6(R86) ; sheet DAC_SW_MUX/CH86
ROW97: ICXTRAP1.U3(R76) ; sheet DAC_SW_MUX/CH76
ROW98: ICXTRAP1.N1(R97) ; sheet DAC_SW_MUX/CH97
ROW99: ICXTRAP1.T4(R123) ; sheet DAC_SW_MUX/CH123
ROW100: ICXTRAP1.U5(R114) ; sheet DAC_SW_MUX/CH114
ROW101: ICXTRAP1.F2(R126) ; sheet DAC_SW_MUX/CH126
ROW102: ICXTRAP1.G3(R103) ; sheet DAC_SW_MUX/CH103
ROW103: ICXTRAP1.N7(R70) ; sheet DAC_SW_MUX/CH70
ROW104: ICXTRAP1.E1(R102) ; sheet DAC_SW_MUX/CH102
ROW105: ICXTRAP1.V2(R67) ; sheet DAC_SW_MUX/CH67
ROW106: ICXTRAP1.U1(R73) ; sheet DAC_SW_MUX/CH73
ROW107: ICXTRAP1.T2(R79) ; sheet DAC_SW_MUX/CH79
ROW108: ICXTRAP1.R1(R82) ; sheet DAC_SW_MUX/CH82
ROW109: ICXTRAP1.E3(R128) ; sheet DAC_SW_MUX/CH128
ROW110: ICXTRAP1.B2(R71) ; sheet DAC_SW_MUX/CH71
ROW111: ICXTRAP1.C1(R127) ; sheet DAC_SW_MUX/CH127
ROW112: ICXTRAP1.D2(R104) ; sheet DAC_SW_MUX/CH104
ROW113: ICXTRAP1.AJ3(R84) ; sheet DAC_SW_MUX/CH84
ROW114: ICXTRAP1.AK2(R90) ; sheet DAC_SW_MUX/CH90
ROW115: ICXTRAP1.AL1(R93) ; sheet DAC_SW_MUX/CH93
ROW116: ICXTRAP1.AC7(R74) ; sheet DAC_SW_MUX/CH74
ROW117: ICXTRAP1.AE1(R115) ; sheet DAC_SW_MUX/CH115
ROW118: ICXTRAP1.AD2(R121) ; sheet DAC_SW_MUX/CH121
ROW119: ICXTRAP1.AC3(R124) ; sheet DAC_SW_MUX/CH124
ROW120: ICXTRAP1.AC1(R94) ; sheet DAC_SW_MUX/CH94
ROW121: ICXTRAP1.AN3(R65) ; sheet DAC_SW_MUX/CH65
ROW122: ICXTRAP1.AL3(R75) ; sheet DAC_SW_MUX/CH75
ROW123: ICXTRAP1.AM2(R78) ; sheet DAC_SW_MUX/CH78
ROW124: ICXTRAP1.AN1(R81) ; sheet DAC_SW_MUX/CH81
ROW125: ICXTRAP1.W7(R107) ; sheet DAC_SW_MUX/CH107
ROW126: ICXTRAP1.Y6(R98) ; sheet DAC_SW_MUX/CH98
ROW127: ICXTRAP1.AA5(R92) ; sheet DAC_SW_MUX/CH92
ROW128: ICXTRAP1.AB4(R83) ; sheet DAC_SW_MUX/CH83
ROW_DIN1: sheet DAC_SW_MUX/DIN1, sheet levelShifter2/OUT1
ROW_DIN1_FPGA: FMC_HPC1.D24(LA23_N) ; sheet levelShifter2/IN1
ROW_DIN2: sheet DAC_SW_MUX/DIN2, sheet levelShifter2/OUT2
ROW_DIN2_FPGA: FMC_HPC1.D23(LA23_P) ; sheet levelShifter2/IN2
ROW_DIN3: sheet DAC_SW_MUX/DIN3, sheet levelShifter2/OUT3
ROW_DIN3_FPGA: FMC_HPC1.D21(LA17_N_CC) ; sheet levelShifter2/IN3
ROW_DIN4: sheet DAC_SW_MUX/DIN4, sheet levelShifter2/OUT4
ROW_DIN4_FPGA: FMC_HPC1.D20(LA17_P_CC) ; sheet levelShifter2/IN4
ROW_DIN5: sheet DAC_SW_MUX/DIN5, sheet levelShifter2/OUT5
ROW_DIN5_FPGA: FMC_HPC1.D18(LA13_N) ; sheet levelShifter2/IN5
ROW_DIN6: sheet DAC_SW_MUX/DIN6, sheet levelShifter2/OUT6
ROW_DIN6_FPGA: FMC_HPC1.D17(LA13_P) ; sheet levelShifter2/IN6
ROW_DIN7: sheet DAC_SW_MUX/DIN7, sheet levelShifter2/OUT7
ROW_DIN7_FPGA: FMC_HPC1.D15(LA09_N) ; sheet levelShifter2/IN7
ROW_DIN8: sheet DAC_SW_MUX/DIN8, sheet levelShifter2/OUT8
ROW_DIN8_FPGA: FMC_HPC1.D14(LA09_P) ; sheet levelShifter2/IN8
ROW_DIN9: sheet DAC_SW_MUX/DIN9, sheet levelShifter3/OUT1
ROW_DIN9_FPGA: FMC_HPC1.F14(HA12_N) ; sheet levelShifter3/IN1
ROW_DIN10: sheet DAC_SW_MUX/DIN10, sheet levelShifter3/OUT2
ROW_DIN10_FPGA: FMC_HPC1.F13(HA12_P) ; sheet levelShifter3/IN2
ROW_DIN11: sheet DAC_SW_MUX/DIN11, sheet levelShifter3/OUT3
ROW_DIN11_FPGA: FMC_HPC1.F11(HA08_N) ; sheet levelShifter3/IN3
ROW_DIN12: sheet DAC_SW_MUX/DIN12, sheet levelShifter3/OUT4
ROW_DIN12_FPGA: FMC_HPC1.F10(HA08_P) ; sheet levelShifter3/IN4
ROW_DIN13: sheet DAC_SW_MUX/DIN13, sheet levelShifter3/OUT5
ROW_DIN13_FPGA: FMC_HPC1.F8(HA04_N) ; sheet levelShifter3/IN5
ROW_DIN14: sheet DAC_SW_MUX/DIN14, sheet levelShifter3/OUT6
ROW_DIN14_FPGA: FMC_HPC1.F7(HA04_P) ; sheet levelShifter3/IN6
ROW_DIN15: sheet DAC_SW_MUX/DIN15, sheet levelShifter3/OUT7
ROW_DIN15_FPGA: FMC_HPC1.F5(HA00_N_CC) ; sheet levelShifter3/IN7
ROW_DIN16: sheet DAC_SW_MUX/DIN16, sheet levelShifter3/OUT8
ROW_DIN16_FPGA: FMC_HPC1.F4(HA00_P_CC) ; sheet levelShifter3/IN8
SCLKSerDes: FMC_HPC1.K23(HA23_N) ; sheet SerDes1/SCLK
Select1: ICXTRAP1.C3(SC4) ; sheet levelShifter7/OUT8
Select2: ICXTRAP1.C5(SC7) ; sheet levelShifter7/OUT7
Select3: ICXTRAP1.D12(SC3) ; sheet levelShifter7/OUT6
Select4: ICXTRAP1.F12(SC1) ; sheet levelShifter7/OUT5
Select5: ICXTRAP1.G13(SC6) ; sheet levelShifter7/OUT4
Select6: ICXTRAP1.A17(SC2) ; sheet levelShifter7/OUT3
Select7: ICXTRAP1.B18(SC5) ; sheet levelShifter7/OUT2
Select8: ICXTRAP1.A19(SC8) ; sheet levelShifter7/OUT1
Select9: ICXTRAP1.C33(SR13) ; sheet levelShifter6/OUT8
Select10: ICXTRAP1.E33(SR10) ; sheet levelShifter6/OUT7
Select11: ICXTRAP1.M30(SR14) ; sheet levelShifter6/OUT6
Select12: ICXTRAP1.L31(SR16) ; sheet levelShifter6/OUT5
Select13: ICXTRAP1.M32(SR11) ; sheet levelShifter6/OUT4
Select14: ICXTRAP1.U35(SR15) ; sheet levelShifter6/OUT3
Select15: ICXTRAP1.V34(SR12) ; sheet levelShifter6/OUT2
Select16: ICXTRAP1.W35(SR9) ; sheet levelShifter6/OUT1
Select17: ICXTRAP1.J1(SR8) ; sheet levelShifter4/OUT8
Select18: ICXTRAP1.K2(SR5) ; sheet levelShifter4/OUT7
Select19: ICXTRAP1.L3(SR2) ; sheet levelShifter4/OUT6
Select20: ICXTRAP1.V4(SR6) ; sheet levelShifter4/OUT5
Select21: ICXTRAP1.V6(SR3) ; sheet levelShifter4/OUT4
Select22: ICXTRAP1.AG1(SR1) ; sheet levelShifter4/OUT3
Select23: ICXTRAP1.AF2(SR4) ; sheet levelShifter4/OUT2
Select24: ICXTRAP1.AE3(SR7) ; sheet levelShifter4/OUT1
Select25: ICXTRAP1.AP12(SC9) ; sheet levelShifter5/OUT8
Select26: ICXTRAP1.AR13(SC15) ; sheet levelShifter5/OUT7
Select27: ICXTRAP1.AN13(SC12) ; sheet levelShifter5/OUT6
Select28: ICXTRAP1.AM20(SC11) ; sheet levelShifter5/OUT5
Select29: ICXTRAP1.AK20(SC14) ; sheet levelShifter5/OUT4
Select30: ICXTRAP1.AN27(SC10) ; sheet levelShifter5/OUT3
Select31: ICXTRAP1.AR29(SC13) ; sheet levelShifter5/OUT2
Select32: ICXTRAP1.AR31(SC16) ; sheet levelShifter5/OUT1
SerDesVin: sheet SerDes1/VDD, sheet levelShifter4/VCCA, sheet levelShifter5/VCCA, sheet levelShifter6/VCCA, sheet levelShifter7/VCCA, sheet ADJ_LDO_10/VOUT
SerDesVout: sheet levelShifter4/VCCB, sheet levelShifter5/VCCB, sheet levelShifter6/VCCB, sheet levelShifter7/VCCB, sheet ADJ_LDO_11/VOUT
SI1: FMC_HPC1.K22(HA23_P) ; sheet SerDes1/SI1
SI2: FMC_HPC1.K14(HA10_N) ; sheet SerDes1/SI2
SO1: FMC_HPC1.K20(HA21_N) ; sheet SerDes1/SO1
SO2: FMC_HPC1.K13(HA10_P) ; sheet SerDes1/SO2
SW_~{RESET}: sheet BT_SW_MUX/~{RESET}, sheet DAC_SW_MUX/~{RESET}, sheet levelShifter1/OUT3
SW_~{RESET}_FPGA: FMC_HPC1.F19(HA19_P) ; sheet levelShifter1/IN3
SW_~{SYNC}: sheet BT_SW_MUX/~{SYNC}, sheet DAC_SW_MUX/~{SYNC}, sheet levelShifter1/OUT2
SW_~{SYNC}_FPGA: FMC_HPC1.F17(HA15_N) ; sheet levelShifter1/IN2
SW_SCLK: sheet BT_SW_MUX/SCLK, sheet DAC_SW_MUX/SCLK, sheet levelShifter1/OUT1
SW_SCLK_FPGA: FMC_HPC1.F16(HA15_P) ; sheet levelShifter1/IN1
VDD1: ICXTRAP1.AD32(VDD1) ; sheet ADJ_LDO_9/VOUT
VDD3: ICXTRAP1.F24(VDD3) ; sheet ADJ_LDO_8/VOUT
VDD_12V: C3.2 C4.2 S1.2(NO) TP1.1 ; sheet 12V_2_5V_1/VDD_12V_in, sheet 12V_2_5V_2/VDD_12V_in, sheet 12V_2_5V_3/VDD_12V_in, sheet 12V_2_5V_4/VDD_12V_in
VDD_Chip: sheet 12V_2_5V_3/VOUT_5V, sheet ADJ_LDO_7/5V_IN, sheet ADJ_LDO_8/5V_IN, sheet ADJ_LDO_9/5V_IN
VDD_IO: sheet ADC_8CH_1/VDD_IO_ADC, sheet ADC_4CH_1/VDD_IO_ADC, sheet ADC_4CH_2/VDD_IO_ADC, sheet ADJ_LDO_3/VOUT, sheet ad7606/VDRIVE, sheet levelShifter1/VCCA, sheet levelShifter2/VCCA, sheet levelShifter3/VCCA
VDD_RD: sheet TIA1/VDD_TIA, sheet TIA2/VDD_TIA, sheet TIA3/VDD_TIA, sheet TIA4/VDD_TIA, sheet TIA5/VDD_TIA, sheet TIA6/VDD_TIA, sheet ADC_8CH_1/VDD_ADC, sheet ADC_4CH_1/VDD_ADC, sheet ADC_4CH_2/VDD_ADC, sheet 12V_2_5V_2/VOUT_5V, sheet ADJ_LDO_3/5V_IN, sheet ADJ_LDO_4/5V_IN, sheet ADJ_LDO_5/5V_IN, sheet ad7606/AVDD, sheet ADJ_LDO_6/5V_IN, sheet BT_SW_MUX/VDD, sheet levelShifter1/VCCB
VDDesd: ICXTRAP1.M6(VDDesd) ; sheet ADJ_LDO_7/VOUT
VIO_DAC1_2: sheet DAC80508Z1/VIO_DAC, sheet DAC80508Z2/VIO_DAC, sheet ADJ_LDO_1/VOUT, sheet DAC3/VLOGIC
VIO_DAC1_3: sheet DAC80508Z4/VIO_DAC, sheet DAC5/VLOGIC
VOUT1: sheet TIA1/VOUT1, sheet ADC_8CH_1/Vin1
VOUT2: sheet TIA1/VOUT2, sheet ADC_8CH_1/Vin2
VOUT3: sheet TIA1/VOUT3, sheet ADC_8CH_1/Vin3
VOUT4: sheet TIA1/VOUT4, sheet ADC_8CH_1/Vin4
VOUT5: sheet TIA2/VOUT1, sheet ADC_8CH_1/Vin5
VOUT6: sheet TIA2/VOUT2, sheet ADC_8CH_1/Vin6
VOUT7: sheet TIA2/VOUT3, sheet ADC_8CH_1/Vin7
VOUT8: sheet TIA2/VOUT4, sheet ADC_8CH_1/Vin8
VOUT9: sheet TIA3/VOUT1, sheet ADC_4CH_1/Vin1
VOUT10: sheet TIA3/VOUT2, sheet ADC_4CH_1/Vin2
VOUT11: sheet TIA3/VOUT3, sheet ADC_4CH_1/Vin3
VOUT12: sheet TIA3/VOUT4, sheet ADC_4CH_1/Vin4
VOUT13: sheet TIA4/VOUT1, sheet ADC_4CH_2/Vin1
VOUT14: sheet TIA4/VOUT2, sheet ADC_4CH_2/Vin2
VOUT15: sheet TIA4/VOUT3, sheet ADC_4CH_2/Vin3
VOUT16: sheet TIA4/VOUT4, sheet ADC_4CH_2/Vin4
VOUT17: sheet TIA5/VOUT1, sheet ad7606/V1
VOUT18: sheet TIA5/VOUT2, sheet ad7606/V2
VOUT19: sheet TIA5/VOUT3, sheet ad7606/V3
VOUT20: sheet TIA5/VOUT4, sheet ad7606/V4
VOUT21: sheet TIA6/VOUT1, sheet ad7606/V5
VOUT22: sheet TIA6/VOUT2, sheet ad7606/V6
VOUT23: sheet TIA6/VOUT3, sheet ad7606/V7
VOUT24: sheet TIA6/VOUT4, sheet ad7606/V8
VREF_ADC: sheet ADC_8CH_1/VREF, sheet ADC_4CH_1/VREF, sheet ADC_4CH_2/VREF, sheet ADJ_LDO_5/VOUT, sheet ad7606/VREF
VREF_ADCref: sheet ad7606/REFIN/REFOUT, sheet ADJ_LDO_6/VOUT
VREF_DAC1_2: sheet DAC80508Z1/VREF, sheet DAC80508Z2/VREF, sheet ADJ_LDO_2/VOUT, sheet DAC3/VREF
VREF_DAC1_3: sheet DAC80508Z4/VREF, sheet DAC5/VREF
VREF_TIA: sheet TIA1/VREF, sheet TIA2/VREF, sheet TIA3/VREF, sheet TIA4/VREF, sheet TIA5/VREF, sheet TIA6/VREF, sheet ADJ_LDO_4/VOUT
NetC1_2: C1.2 C2.2 JP1.1 JP1.2 POWER1.1 S1.1(COMMON)
NetJP2_2: JP2.2 R1.2
NetJP3_2: JP3.2 R2.2
NetJP4_2: JP4.2 R3.2
NetJP5_2: JP5.2 R4.2
NetJP6_2: JP6.2 R5.2
NetJP7_2: JP7.2 R6.2
NetJP8_2: JP8.2 R7.2
NetJP9_2: JP9.2 R8.2
NetJP10_2: JP10.2 R9.2
NetJP11_2: JP11.2 R10.2
NetJP12_2: JP12.2 R11.2
NetJP13_2: JP13.2 R12.2
NetJP14_2: JP14.2 R13.2
NetJP15_2: JP15.2 R14.2
NetJP16_2: JP16.2 R15.2
NetJP17_2: JP17.2 R16.2
NetJP18_2: JP18.2 R17.2
NetJP19_2: JP19.2 R18.2
NetJP20_2: JP20.2 R19.2
NetJP21_2: JP21.2 R20.2
NetJP22_2: JP22.2 R21.2
NetJP23_2: JP23.2 R22.2
NetJP24_2: JP24.2 R23.2
NetJP25_2: JP25.2 R24.2
NetJP26_2: JP26.2 R25.2
NetJP27_2: JP27.2 R26.2
NetJP28_2: JP28.2 R27.2
NetJP29_2: JP29.2 R28.2
NetJP30_2: JP30.2 R29.2
NetJP31_2: JP31.2 R30.2
NetJP32_2: JP32.2 R31.2
NetJP33_2: JP33.2 R32.2
NetJP34_2: JP34.2 R33.2
NetJP35_2: JP35.2 R34.2
NetJP36_2: JP36.2 R35.2
NetJP37_2: JP37.2 R36.2
NetJP38_2: JP38.2 R37.2
NetJP39_2: JP39.2 R38.2
NetJP40_2: JP40.2 R39.2
NetJP41_2: JP41.2 R40.2
NetJP42_2: JP42.2 R41.2
NetJP43_2: JP43.2 R42.2
NetJP44_2: JP44.2 R43.2
NetJP45_2: JP45.2 R44.2
NetJP46_2: JP46.2 R45.2
NetJP47_2: JP47.2 R46.2
NetJP48_2: JP48.2 R47.2
NetJP49_2: JP49.2 R48.2
NetJP50_2: JP50.2 R49.2
NetJP51_2: JP51.2 R50.2
NetJP52_2: JP52.2 R51.2
NetJP53_2: JP53.2 R52.2
NetJP54_2: JP54.2 R53.2
NetJP55_2: JP55.2 R54.2
NetJP56_2: JP56.2 R55.2
NetJP57_2: JP57.2 R56.2
NetJP58_2: JP58.2 R57.2
NetJP59_2: JP59.2 R58.2
NetJP60_2: JP60.2 R59.2
NetJP61_2: JP61.2 R60.2
NetJP62_2: JP62.2 R61.2
NetJP63_2: JP63.2 R62.2
NetJP64_2: JP64.2 R63.2
NetJP65_2: JP65.2 R64.2
NetJP66_2: JP66.2 R65.2
NetJP67_2: JP67.2 R66.2
NetJP68_2: JP68.2 R67.2
NetJP69_2: JP69.2 R68.2
NetJP70_2: JP70.2 R69.2
NetJP71_2: JP71.2 R70.2
NetJP72_2: JP72.2 R71.2
NetJP73_2: JP73.2 R72.2
NetJP74_2: JP74.2 R73.2
NetJP75_2: JP75.2 R74.2
NetJP76_2: JP76.2 R75.2
NetJP77_2: JP77.2 R76.2
NetJP78_2: JP78.2 R77.2
NetJP79_2: JP79.2 R78.2
NetJP80_2: JP80.2 R79.2
NetJP81_2: JP81.2 R80.2
NetJP82_2: JP82.2 R81.2
NetJP83_2: JP83.2 R82.2
NetJP84_2: JP84.2 R83.2
NetJP85_2: JP85.2 R84.2
NetJP86_2: JP86.2 R85.2
NetJP87_2: JP87.2 R86.2
NetJP88_2: JP88.2 R87.2
NetJP89_2: JP89.2 R88.2
NetJP90_2: JP90.2 R89.2
NetJP91_2: JP91.2 R90.2
NetJP92_2: JP92.2 R91.2
NetJP93_2: JP93.2 R92.2
NetJP94_2: JP94.2 R93.2
NetJP95_2: JP95.2 R94.2
NetJP96_2: JP96.2 R95.2
NetJP97_2: JP97.2 R96.2
NetJP98_2: JP98.2 R97.2
NetJP99_2: JP99.2 R98.2
NetJP100_2: JP100.2 R99.2
NetJP101_2: JP101.2 R100.2
NetJP102_2: JP102.2 R101.2
NetJP103_2: JP103.2 R102.2
NetJP104_2: JP104.2 R103.2
NetJP105_2: JP105.2 R104.2

Not connected (* = marked no-connect by the designer): FMC_HPC1 A2(DP1_M2C_P)* A3(DP1_M2C_N)* A6(DP2_M2C_P)* A7(DP2_M2C_N)* A10(DP3_M2C_P)* A11(DP3_M2C_N)* A14(DP4_M2C_P)* A15(DP4_M2C_N)* A18(DP5_M2C_P)* A19(DP5_M2C_N)* A22(DP1_C2M_P)* A23(DP1_C2M_N)* A26(DP2_C2M_P)* A27(DP2_C2M_N)* A30(DP3_C2M_P)* A31(DP3_C2M_N)* A34(DP4_C2M_P)* A35(DP4_C2M_N)* A38(DP5_C2M_P)* A39(DP5_C2M_N)* B1(CLK_DIR)* B4(DP9_M2C_P)* B5(DP9_M2C_N)* B8(DP8_M2C_P)* B9(DP8_M2C_N)* B12(DP7_M2C_P)* B13(DP7_M2C_N)* B16(DP6_M2C_P)* B17(DP6_M2C_N)* B20(GBTCLK1_M2C_P)* B21(GBTCLK1_M2C_N)* B24(DP9_C2M_P)* B25(DP9_C2M_N)* B28(DP8_C2M_P)* B29(DP8_C2M_N)* B32(DP7_C2M_P)* B33(DP7_C2M_N)* B36(DP6_C2M_P)* B37(DP6_C2M_N)* B40(RES0)* C2(DP0_C2M_P)* C3(DP0_C2M_N)* C6(DP0_M2C_P)* C7(DP0_M2C_N)* C30(SCL)* C31(SDA)* C34(GA0)* C35(12P0V)* C37(12P0V)* C39(3P3V)* D1(PG_C2M)* D4(GBT_CLK0_M2C_P)* D5(GBT_CLK0_M2C_N)* D29(TCK)* D30(TDI)* D31(TDO)* D32(3P3VAUX)* D33(TMS)* D34(TRST_L)* D35(GA1)* D36(3P3V)* D38(3P3V)* D40(3P3V)* E21(HB03_P)* E22(HB03_N)* E24(HB05_P)* E25(HB05_N)* E27(HB09_P)* E28(HB09_N)* E30(HB13_P)* E31(HB13_N)* E33(HB19_P)* E34(HB19_N)* E36(HB21_P)* E37(HB21_N)* E39(VADJ)* F1(PG_M2C)* F22(HB02_P)* F23(HB02_N)* F25(HB04_P)* F26(HB04_N)* F28(HB08_P)* F29(HB08_N)* F31(HB12_P)* F32(HB12_N)* F34(HB16_P)* F35(HB16_N)* F37(HB20_P)* F38(HB20_N)* F40(VADJ)* G2(CLK1_M2C_P)* G3(CLK1_M2C_N)* G39(VADJ)* H1(VREF_A_M2C)* H2(PRSNT_M2C_L)* H4(CLK0_M2C_P)* H5(CLK0_M2C_N)* H40(VADJ)* J2(CLK3_BIDIR_P)* J3(CLK3_BIDIR_N)* J24(HB01_P)* J25(HB01_N)* J27(HB07_P)* J28(HB07_N)* J30(HB11_P)* J31(HB11_N)* J33(HB15_P)* J34(HB15_N)* J36(HB18_P)* J37(HB18_N)* J39(VIO_B_M2C)* K1(VREF_B_M2C)* K4(CLK2_BIDIR_P)* K5(CLK2_BIDIR_N)* K25(HB00_P_CC)* K26(HB00_N_CC)* K28(HB06_P_CC)* K29(HB06_N_CC)* K31(HB10_P)* K32(HB10_N)* K34(HB14_P)* K35(HB14_N)* K37(HB17_P_CC)* K38(HB17_N_CC)* K40(VIO_B_M2C)*; ICXTRAP1 AD30* AE5* AE7* AE29* AE31 AF4* AF6* AF30* AF32* AG5* AG7* AG29* AG31* AH4* AH6* AH30* AH32 AJ5* AJ9* AJ11* AJ25* AJ27* AJ31* AK4* AK8* AK10* AK26* AK28* AK32 AL5* AL7* AL9* AL11* AL25* AL27* AL29* AL31* AM4* AM6* AM8* AM10* AM26* AM28* AM30* AM32* D4* D6 D8* D10* D26* D28* D30* D32* E5* E7* E9* E11* E25* E27* E29* E31* F4* F8* F10* F26* F28* F32* G5* G9* G11* G25* G27* G31* H4* H6 H30* H32* J5* J7 J29* J31* K4* K6* K30* K32 L5* L7* L29

## Notes on the sheet
- We cannot use the HB in the FMC connector since it's not connected to the FPGA board.
- The remaining tasks of this PCB board:
  1. Need to add the ground pad for ADG714. (The big pad in the middle)
  2. Need to add the ground pad for 74LVC8T245. (The big pad in the middle)
  3. Need to double check if all of the I/Os can use 1.8V as its supply voltages.
  4. Need to change the column numbers based on the spread sheet.
  5. Need to sperate the digital power and the analog power.
  6. Changed some of the big jumper to the one that Razer was using.
  7. Only thing left is the SPI block, I need to figure out how is the SPI block working.
  8. (Done) Testing the voltage regulator, see if they can generate the expected voltages.
  9. Need to understand what is INTA,B used for in MCO23S17.
  10. Need to double check the connection of the DAC80508 in both the schematic and the layout.
  11. Seems the regulator has some problem
- Change it to jumpers
- BT_SW_MUX is a switching matrix that muxes the ADC and DAC to the  column of the chip.
  VDD_RD -> 5V Fixed Power supply
- Labels drawn without touching a wire or pin: ADC4_D12, ADC4_D13, ADC4_D14, ADC4_D15

## Library data of the parts
C1-C4 = UMK212SD103KD-T: CAP 10nF 50V RF; Manufacturer: Taiyo Yuden; Dielectric Material: Ceramic; Tolerance: 10%; Supplier 1: Digi-Key; Manufacturer Part Number: UMK212SD103KD-T; Stock 1: 14125; Pricing 1: 1=0.47, 10=0.323, 100=0.1941, 500=0.1455, 1000=0.1229 (USD); Mount: Surface Mount; Case/Package: 0805; Number of Pins: 2; Case Code (Metric): 2012; Case Code (Imperial): 0805; Min Operating Temperature: -55°C; Max Operating Temperature: 125°C; Capacitance: 10nF; Packaging: Tape and Reel; Package Quantity: 1; Voltage Rating: 50V; Voltage Rating (DC): 50V; Termination: SMD/SMT; Length: 2mm; Height: 0.85mm; Width: 0.049inch; Thickness: 0.037inch; Depth: 1.25mm; Radiation Hardening: No; Lead Free: Lead Free; Halogen Free: Halogen Free; ComponentLink1URL: https://datasheet.ciiva.com/138/umk212sd103kd-t-ss-138661.pdf; ComponentLink1Description: https://datasheet.ciiva.com/138/umk212sd103kd-t-ss-138661.pdf; ComponentLink2URL: https://datasheet.ciiva.com/138/mlcc07-e-138662.pdf; ComponentLink2Description: https://datasheet.ciiva.com/138/mlcc07-e-138662.pdf; ComponentLink3URL: https://datasheet.ciiva.com/138/mlcc07-e-138663.pdf; ComponentLink3Description: https://datasheet.ciiva.com/138/mlcc07-e-138663.pdf; ComponentLink4URL: https://datasheet.ciiva.com/30140/303umk212sd103kd-t-30140925.pdf; ComponentLink4Description: https://datasheet.ciiva.com/30140/303umk212sd103kd-t-30140925.pdf; Supplier Part Number 1: 587-1114-1-ND
ICXTRAP1 = PGA391: ICXTRAP1
JP1 = 68000-204HLF: B.II CONN HEADER 4POS .100 STR 15AU; Manufacturer: Amphenol FCI; Voltage Rating: 1.5kV; Number of Positions: 4; Gender: Male; Connector Type: Male Pin; Current Rating: 3A; Insulation Resistance: 5GR; Pitch: 2.54mm; Mating Post Length: 5.84mm; Supplier 1: Digi-Key; Manufacturer Part Number: 68000-204HLF; Stock 1: 4921; Pricing 1: 1=0.31, 10=0.293, 100=0.2048, 500=0.1756, 1000=0.1463, 5000=0.1254, 10000=0.117 (USD); Mount: Through Hole; Colour: Black; Housing Colour: Black; Housing Material: Thermoplastic; Contact Plating: Nickel,Gold,GXT; Contact Material: Bronze; Min Operating Temperature: -65°C; Max Operating Temperature: 125°C; Package Quantity: 100; Number of Rows: 1; Packaging: Bulk; Contact Gender: Male; Termination: Solder; Max Voltage Rating (AC): 1.5kV; Number of Contacts: 4; Orientation: Straight; Length: 10.16mm; Depth: 2.41mm; Contact Mating Length: 0.23inch; Termination Post Length: 2.41mm; Radiation Hardening: No; Flammability Rating: UL94 V-0; ComponentLink1URL: https://datasheet.ciiva.com/728/68000-728901.pdf; ComponentLink1Description: https://datasheet.ciiva.com/728/68000-728901.pdf; ComponentLink2URL: https://datasheet.ciiva.com/22873/70302489-22873093.pdf; ComponentLink2Description: https://datasheet.ciiva.com/22873/70302489-22873093.pdf; ComponentLink3URL: https://datasheet.ciiva.com/10149/68000-10149835.pdf; ComponentLink3Description: https://datasheet.ciiva.com/10149/68000-10149835.pdf; ComponentLink4URL: https://datasheet.ciiva.com/5149/68000-274280-5149869.pdf; ComponentLink4Description: https://datasheet.ciiva.com/5149/68000-274280-5149869.pdf; ComponentLink5URL: https://datasheet.ciiva.com/46395/1914865-46395853.pdf; ComponentLink5Description: https://datasheet.ciiva.com/46395/1914865-46395853.pdf; Supplier Part Number 1: 609-3255-ND
JP2-JP105 = 01x02: 01X02 generic terminal connector
MH1-MH4 = MH_7.4MMC_3.2MMC: Mounting Hole 7.4mm Diameter, 3.2mm Drill
POWER1 = PWR-2.1MM: PJ-002AH; Manufacturer: CUI; Gender: Male; Shielding: Unshielded; Connector Type: Jack; Current Rating: 5A; Number of Conductors: 2; Voltage Rating: 24V; Insulation Resistance: 50MR; Supplier 1: Digi-Key; Manufacturer Part Number: PJ-002AH; Stock 1: 95768; Pricing 1: 1=0.74, 10=0.696, 25=0.6264, 50=0.5568, 100=0.5336, 250=0.4872, 500=0.464, 1000=0.3828, 2500=0.348 (USD); Mount: Through Hole; Colour: Black; Contact Material: Copper,Copper Alloy; Contact Plating: Nickel; Housing Material: Thermoplastic; Housing Colour: Black; Min Operating Temperature: -25°C; Max Operating Temperature: 85°C; Packaging: Bulk; Termination: Through Hole; Orientation: Horizontal; Package Quantity: 500; Contact Gender: Male; Diameter: 2.1mm; Lead Free: Lead Free; Flammability Rating: UL94 V-0; ComponentLink1URL: http://www.cui.com/Product/Resource/FuturePDF/PJ-002AH.pdf; ComponentLink1Description: http://www.cui.com/Product/Resource/FuturePDF/PJ-002AH.pdf; ComponentLink2URL: http://www.cui.com/product/resource/digikeypdf/pj-002ah.pdf; ComponentLink2Description: http://www.cui.com/product/resource/digikeypdf/pj-002ah.pdf; ComponentLink3URL: http://www.mouser.com/ds/2/670/pj-002ah-516007.pdf; ComponentLink3Description: http://www.mouser.com/ds/2/670/pj-002ah-516007.pdf; Supplier Part Number 1: CP-002AH-ND
R1-R104 = RES
S1 = SW-SPST: L101011MS02Q; Manufacturer: ITT C&K; Actuator Material: Nylon,Polyamide; Max Voltage Rating (AC): 250V; Max Voltage Rating (DC): 125V; Throw Configuration: SPST; Max Current Rating: 4A; Voltage Rating (DC): 28V; Contact Current Rating: 2A; Electrical Life: 10000Cycles; Switch Travel: 3.81mm; Switch Function: On-Off; Actuator Length: 5.08mm; Supplier 1: Digi-Key; Manufacturer Part Number: L101011MS02Q; Stock 1: 8267; Pricing 1: 1=1.65, 10=1.584, 25=1.5504, 50=1.3482, 100=1.3145, 250=1.2808, 500=1.0786, 1000=1.0112, 5000=0.9269 (USD); Mount: Through Hole; Contact Material: Copper; Contact Plating: Silver; Housing Material: Nylon; Min Operating Temperature: -30°C; Max Operating Temperature: 65°C; Termination: PC Pins; Voltage Rating (AC): 125V; Package Quantity: 1; Packaging: Bulk; Current Rating: 4A; Orientation: Straight; Length: 19.1mm; Depth: 10.8mm; Radiation Hardening: No; Lead Free: Lead Free; ComponentLink1URL: https://datasheet.ciiva.com/17406/l-10jun14-17406600.pdf; ComponentLink1Description: https://datasheet.ciiva.com/17406/l-10jun14-17406600.pdf; ComponentLink2URL: https://datasheet.ciiva.com/18147/getdatasheetpartid-301248-18147196.pdf; ComponentLink2Description: https://datasheet.ciiva.com/18147/getdatasheetpartid-301248-18147196.pdf; ComponentLink3URL: https://datasheet.ciiva.com/2889/l-10jun14-2889869.pdf; ComponentLink3Description: https://datasheet.ciiva.com/2889/l-10jun14-2889869.pdf; Supplier Part Number 1: CKC5106-ND
TP1 = Testing_Port: 01X01 generic terminal connector